# EAGLE design Adafruit LM73100 Ideal Diode Breakout (EAGLE 9.6.2)
COMPANY: ADAFRUIT INDUSTRIES; DRAWN: KTOWN; REV: A
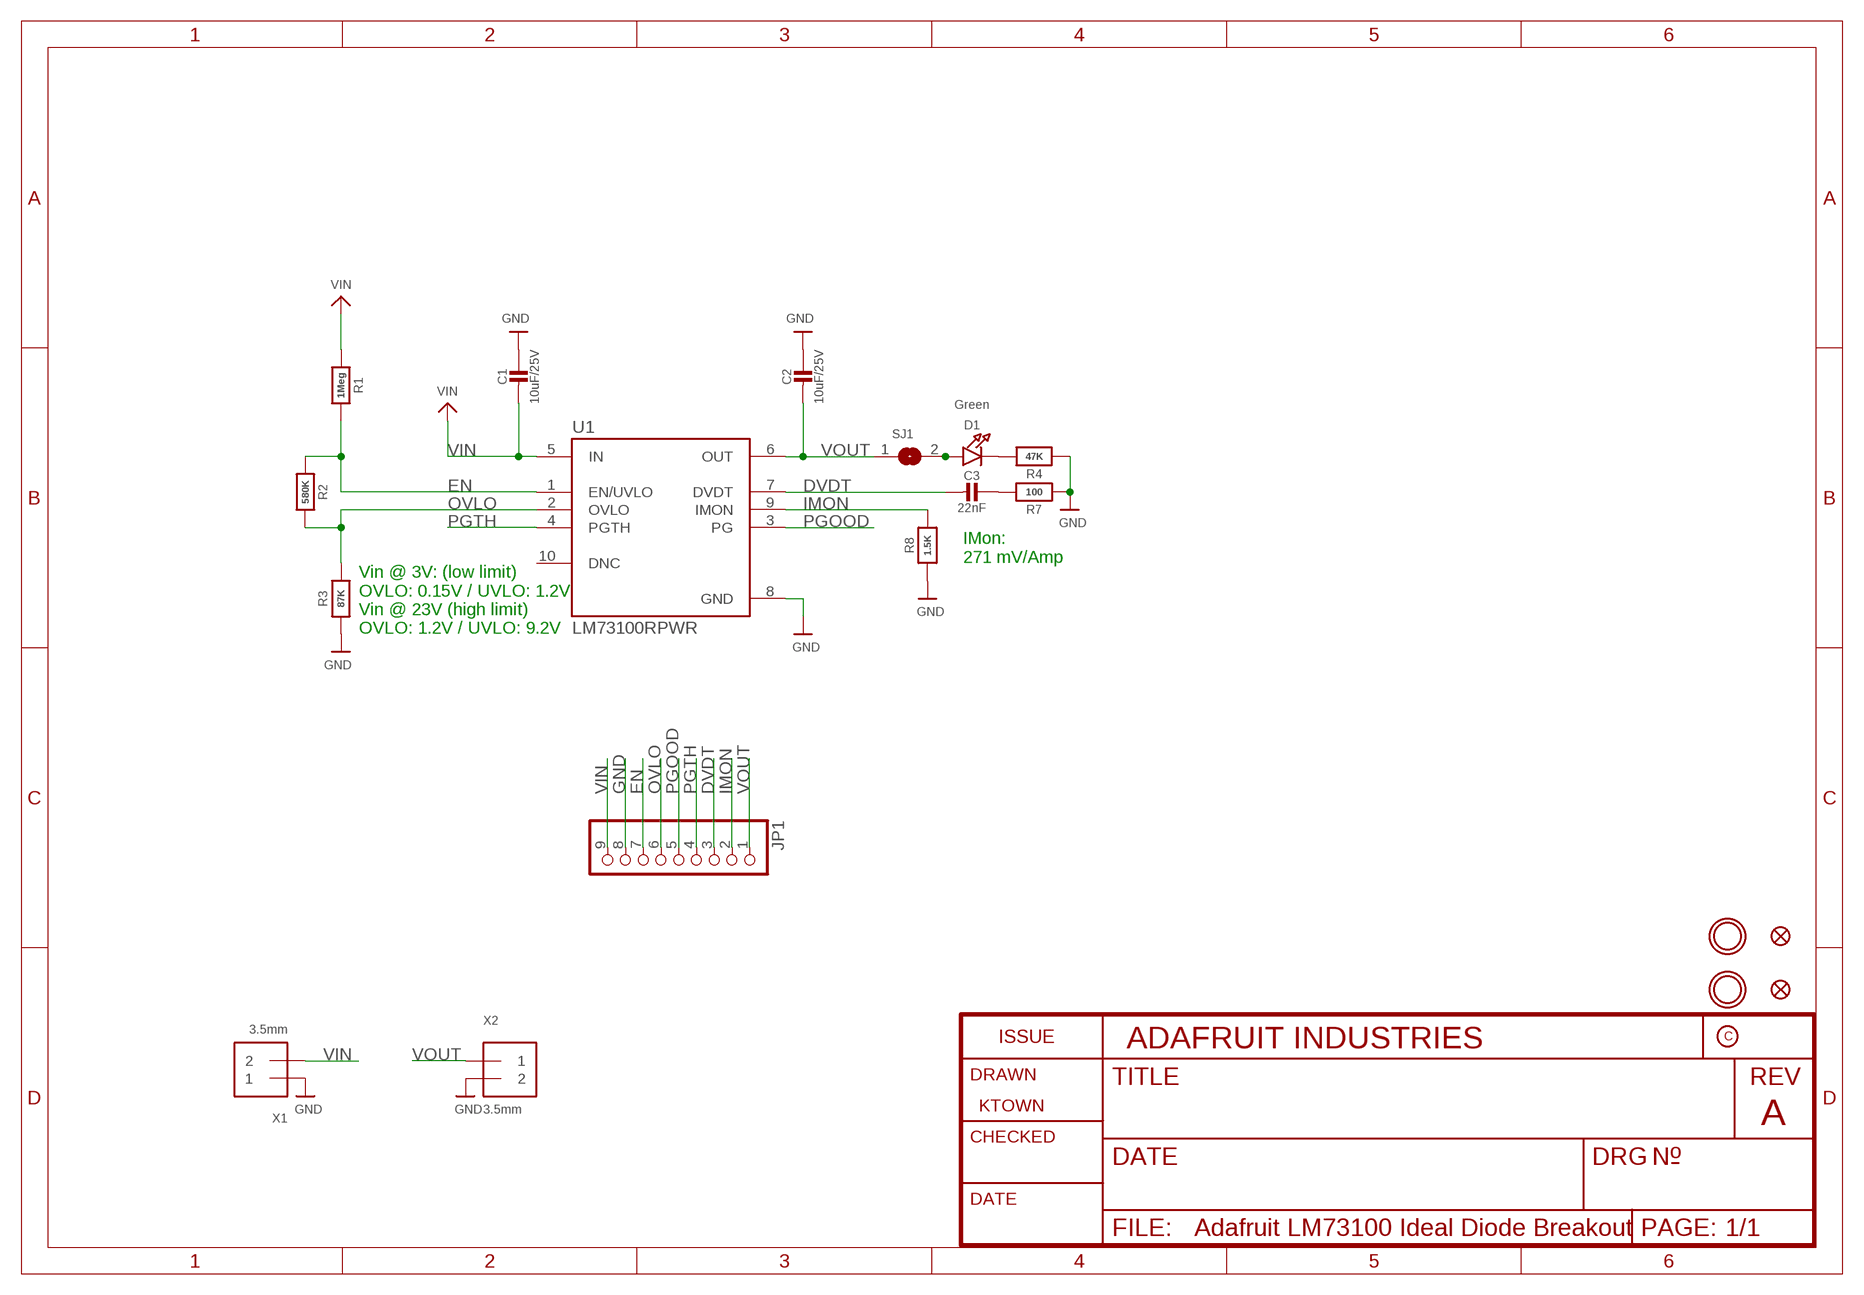
[diagram p0: schematic, sheet 1]

## Parts
C1  10uF/25V  CAP_CERAMIC0805-NOOUTLINE  [0805-NO]
C2  10uF/25V  CAP_CERAMIC0805-NOOUTLINE  [0805-NO]
C3  22nF  CAP_CERAMIC0603_NO  [0603-NO]
D1  Green  LED0603_NOOUTLINE  [CHIPLED_0603_NOOUTLINE]
FID1  FIDUCIAL_0.5MM  [FIDUCIAL_0.5MM]
FID2  FIDUCIAL_0.5MM  [FIDUCIAL_0.5MM]
JP1  HEADER-1X970MIL  [1X09_ROUND_70]
R1  1Meg  RESISTOR_0603_NOOUT  [0603-NO]
R2  580K  RESISTOR_0603_NOOUT  [0603-NO]
R3  87K  RESISTOR_0603_NOOUT  [0603-NO]
R4  47K  RESISTOR_0603_NOOUT  [0603-NO]
R7  100  RESISTOR_0603_NOOUT  [0603-NO]
R8  1.5K  RESISTOR_0402NO  [_0402NO]
SJ1  SOLDERJUMPERCLOSED  [SOLDERJUMPER_CLOSEDWIRE]
U1  LM73100RPWR  [IC_LM73100RPWR]
U$1  MOUNTINGHOLE2.5  [MOUNTINGHOLE_2.5_PLATED]
U$9  MOUNTINGHOLE2.5  [MOUNTINGHOLE_2.5_PLATED]
X1  3.5mm  TERMBLOCK_1X2_3.5MM  [TERMBLOCK_1X2-3.5MM]
X2  3.5mm  TERMBLOCK_1X2_3.5MM  [TERMBLOCK_1X2-3.5MM]

## Nets
DVDT: C3.2 JP1.3 U1.7(DVDT)
EN: JP1.7 R1.1 R2.2 U1.1(EN/UVLO)
GND: C1.1 C2.1 JP1.8 R3.2 R4.2 R7.1 R8.1 U1.8(GND) X1.1 X2.2
IMON: JP1.2 R8.2 U1.9(IMON)
N$1: C3.1 R7.2
N$2: D1.C R4.1
N$3: D1.A SJ1.2
OVLO: JP1.6 R2.1 R3.1 U1.2(OVLO)
PGOOD: JP1.5 U1.3(PG)
PGTH: JP1.4 U1.4(PGTH)
VIN: C1.2 JP1.9 R1.2 U1.5(IN) X1.2
VOUT: C2.2 JP1.1 SJ1.1 U1.6(OUT) X2.1
Unconnected: U1.10(DNC)

## Notes on the sheet
- IMon:
  271 mV/Amp
- Vin @ 3V: (low limit)
  OVLO: 0.15V / UVLO: 1.2V
  Vin @ 23V (high limit)
  OVLO: 1.2V / UVLO: 9.2V

## Library data of the parts
C1-C3 = microbuilder:CAP_CERAMIC: Ceramic Capacitors For new designs, use the packages preceded by an '_' character since they are more reliable: The following footprints should be used on most boards: _0402 - Standard footprint for regular board layouts _0603 - Standard footprint for regular board layouts _0805 - Standard footprint for regular board layouts _1206 - Standard footprint for regular board layouts For extremely tight-pitch boards where space is at a premium, the following 'micro-pitch' footprints can be used (smaller pads, no silkscreen outline, etc.): _0402MP - Micro-pitch footprint for very dense/compact boards _0603MP - Micro-pitch footprint for very dense/compact boards _0805MP - Micro-pitch footprint for very dense/compact boards _1206MP - Micro-pitch footprint for very dense/compact boards
D1 = microbuilder:LED: LED 0603 - 0603 Surface Mount Package 2mA: Green LED - Low Power (3.9mcd, 2ma, 1.7Vf) - Digikey: 475-2709-2-ND Orange LED - Low Power (9.8mcd, 2ma, 1.8Vf) - Digikey: 475-1194-2-ND Red LED - Low Power (5mcd, 2ma, 1.8Vf) - Digikey: 475-1195-2-ND Yellow LED - Low Power (7mcd, 2ma, 1.8Vf) - Digikey: 475-1196-2-ND 5mA: Blue LED - Low Power (17mcd, 5ma, 2.9Vf) - Digikey: LNJ937W8CRACT-ND 0805 - 0805 Surface Mount Package 2mA: Red LED (8.8mcd, 2mA, 1.8Vf, Clear) - Low Power [Digikey: 475-2510-1-ND] Green LED (5mcd, 2mA, 1.8Vf, Clear) - Low Power [Digikey: 475-2730-1-ND] Yellow LED (11.3mcd, 2mA, 1.8Vf, Clear) - Low Power [Digikey: 475-2555-1-ND] 20mA: Red LED (104mcd, 20mA, Diffused) - LS R976 [Digikey: 475-1278-6-ND] Red LED (12mcd, 20mA, 2.0Vf, Clear) - APT2012EC [Digikey: 754-1128-1-ND] Green LED (15mcd, 20mA, 2.2Vf, Clear) - APT2012GC [Digikey: 754-1131-1-ND] Orange LED (160mcd, 20mA, 2.1Vf, Clear) - APT2012SECK [Digikey: 754-1130-1-ND] 1206 - 1206 Surface Mount Package Green LED (26mcd, 20mA, Diffused) - LG N971 [Digikey: 475-1407-6-ND] Red LED (15mcd, 20mA, Diffused) - LH N974 [Digikey: 475-1416-6-ND] Cree - Cree High-Power Surface Mount LEDs XPEBWT-L1-0000-00D50 - White 111lm 350mA 2.9Vf 6200K 110° XTEAWT-00-0000-00000LEE3 - White 114lm 350mA 2.85Vf 5000K 115° Everlight - Everlight 45-21 Series Surface Mount LEDs 45-21/QK2C-B2832AC2CB2/2T - Warm White 2000mcd 20mA 3.25Vf 3050K 120° 45-21/LK2C-B38452C4CB2/2T - Nuetral White 2000mcd 20mA 3.25Vf 4150K 120° 45-21/LK2C-B50634C6CB2/2T - Cold White 2200mcd 20mA 3.25Vf 5650K 120° PLCC2 Reverse Mount LS T77K-J1L2-1-0-2-R18-Z - Red 11.25mcd 2mA 1.8Vf 630nm 120° LO T77K-L1M2-24-Z - Orange 19.6mcd 2mA 1.8Vf 606nm 120° LY T77K-K2M1-26-Z - Yellow 15.7mcd 2mA 1.8Vf 587nm 120°; ROT: 270
FID1 FID2 = microbuilder:FIDUCIAL: Fiducial Alignment Points Various fiducial points for machine vision alignment.
JP1 = microbuilder:HEADER-1X9: PIN HEADER
R1-R4 R7 R8 = microbuilder:RESISTOR: Resistors For new designs, use the packages preceded by an '_' character since they are more reliable: The following footprints should be used on most boards: _0402 - Standard footprint for regular board layouts _0603 - Standard footprint for regular board layouts _0805 - Standard footprint for regular board layouts _1206 - Standard footprint for regular board layouts For extremely tight-pitch boards where space is at a premium, the following 'micro-pitch' footprints can be used (smaller pads, no silkscreen outline, etc.): _0402MP - Micro-pitch footprint for very dense/compact boards _0603MP - Micro-pitch footprint for very dense/compact boards _0805MP - Micro-pitch footprint for very dense/compact boards _1206MP - Micro-pitch footprint for very dense/compact boards
SJ1 = microbuilder:SOLDERJUMPER: SMD Solder JUMPER Solder the two pads together to create a connection, or remove the solder to break it. REFLOW - Use this footprint for solder paste and reflow ovens. WAVE - Use this footprint for hand-soldering (larger pads). CLOSED - Has a trace between the two pads to ensure it is closed by default. The trace needs to be cut to disable the jumper, and can be closed again by creating a solder bridge between the two pads.
U1 = adafruit_power:LM73100RPWR; MANUFACTURER: Texas Instruments; MAXIMUM_PACKAGE_HEIGHT: 1 mm; PARTREV: 08/2019; SNAPEDA_PN: LM73100RPWR; STANDARD: Manufacturer Recommendations
U$1 U$9 = adafruit_electromech:MOUNTINGHOLE: Mounting Hole For #2 screws (0.086"/2.18mm width, 0.094"/2.4mm hole) use 2.5mm; BOM: EXCLUDE
X1 X2 = adafruit_electromech:TERMBLOCK_1X2: 3.5mm Terminal block http://www.ladyada.net/library/pcb/eaglelibrary.html; ROT: 0

## Board
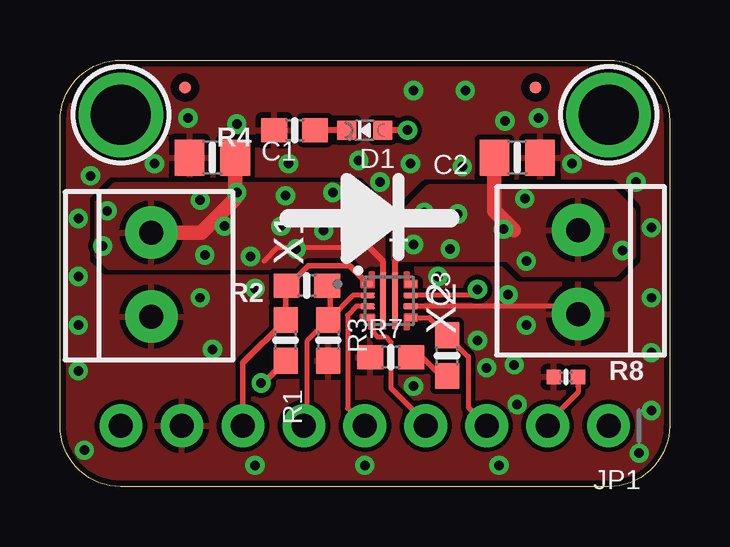
[diagram p1: board, top side]
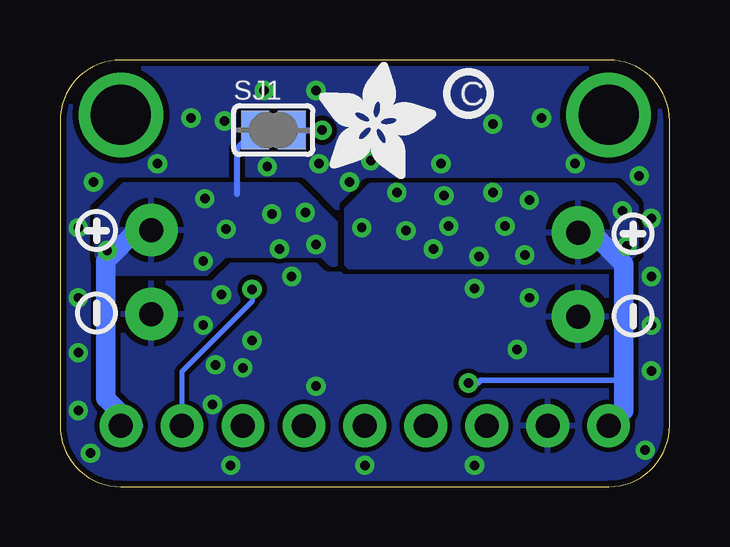
[diagram p2: board, bottom side, seen from below]

Size 25.4 x 17.78 mm. Coordinates in mm from the lower left corner, seen from the top.
Outline: 22.86,0 2.54,0 arc-90 0,2.54 0,15.24 arc-90 2.54,17.78 22.86,17.78 arc-90 25.4,15.24 25.4,2.54 arc-90 22.86,0
Copper layers (1*16): Top 0.035mm / dielectric 1.5mm / Bottom 0.035mm
Design rules "adafruit *": minimum track width 8mil, minimum drill 15.5mil, track to track 8mil, track to pad 8mil, pad to pad 8mil, via to via 8mil, smd to smd 8mil, copper to edge 10mil, drill to drill 8mil, minimum pad ring 10mil, minimum via ring 8mil, stop-mask expansion 2mil, vias tented up to drill 20mil, thermal gap 10mil

### Footprints (pad centres in the part's own frame; a part is rotated, then mirrored left to right if it is on the bottom)
0805-NO = smd 1.24 x 1.5: 1 -0.95,0; 2 0.95,0
0603-NO = smd 1.075 x 1: 1 -0.85,0; 2 0.85,0
CHIPLED_0603_NOOUTLINE = smd 0.8 x 0.8: A 0,-0.75; C 0,0.75
FIDUCIAL_0.5MM = smd 0.5 x 0.5: 1 0,0
1X09_ROUND_70 = drill 1 pad 1.778: 1 -10.16,0; 2 -7.62,0; 3 -5.08,0; 4 -2.54,0; 5 0,0; 6 2.54,0; 7 5.08,0; 8 7.62,0; 9 10.16,0
_0402NO = smd 0.6 x 0.6: 1 -0.508,0; 2 0.508,0
SOLDERJUMPER_CLOSEDWIRE = smd 1.168 x 1.6: 1 -0.762,0; 2 0.762,0 | smd 0.635 x 0.203: WIRE 0,0
IC_LM73100RPWR = smd 0.5 x 0.25: 1 -0.9,0.7; 4 -0.9,-0.7; 7 0.9,-0.7; 10 0.9,0.7 | smd 0.6 x 0.225: 2 -0.9,0.225; 3 -0.9,-0.225; 8 0.9,-0.225; 9 0.9,0.225 | smd 0.28 x 2.4: 5 -0.25,0; 6 0.25,0
MOUNTINGHOLE_2.5_PLATED = drill 2.5 pad 3.2: P$1 0,0
TERMBLOCK_1X2-3.5MM = drill 1 pad 2.184: 1 1.8,0; 2 -1.7,0

### Placement (x,y rotation side)
C1  6.35,13.72 0 top
C2  19.05,13.72 180 top
C3  16.13,5.46 90 top
D1  12.7,14.86 90 top
FID1  19.81,16.64 0 top
FID2  5.21,16.64 0 top
JP1  12.7,2.54 180 top
PLABEL2  [PLABEL2]  5.08,0.89 0 top
PLABEL3  [PLABEL3]  23.62,4.19 0 top
PLABEL7  [PLABEL7]  2.54,4.19 0 top
PLABEL8  [PLABEL8]  12.45,16.51 0 top
PLABEL9  [PLABEL9]  12.57,13.72 0 top
PLABEL10  [PLABEL10]  8.13,10.79 90 top
PLABEL12  [PLABEL12]  8.13,6.99 90 top
PLABEL13  [PLABEL13]  17.4,7.24 90 top
PLABEL14  [PLABEL14]  7.75,4.19 0 top
PLABEL15  [PLABEL15]  10.41,0.89 0 top
PLABEL16  [PLABEL16]  12.7,4.06 0 top
PLABEL17  [PLABEL17]  15.37,0.89 0 top
PLABEL18  [PLABEL18]  18.29,4.19 0 top
PLABEL19  [PLABEL19]  20.45,0.89 0 top
PLABEL20  [PLABEL20]  12.7,11.3 0 bottom
PLABEL21  [PLABEL21]  12.7,7.37 0 bottom
PLABEL22  [PLABEL22]  16.38,16.64 0 bottom
PLABEL23  [PLABEL23]  22.99,12.83 0 bottom
PLABEL24  [PLABEL24]  1.91,12.57 0 bottom
PLABEL25  [PLABEL25]  17.4,11.3 90 top
R1  9.4,6.1 270 top
R2  10.29,8.38 180 top
R3  11.18,6.1 270 top
R4  9.78,14.86 180 top
R7  13.78,5.4 0 top
R8  21.08,4.57 0 top
SJ1  16.51,14.86 0 bottom
U1  13.72,7.75 0 top
U$1  22.86,15.49 0 top
U$9  2.54,15.49 0 top
U$10  [PCBFEAT-REV-040]  8.38,16.38 0 bottom
U$14  [ADAFRUIT_5MM]  14.61,12.83 0 bottom
U$15  [SYMBOL_MINUS]  23.88,7.24 270 bottom
U$16  [SYMBOL_PLUS]  23.88,10.67 0 bottom
U$17  [SYMBOL_PLUS]  1.52,10.54 0 bottom
U$18  [SYMBOL_MINUS]  1.52,7.11 270 bottom
X1  3.81,8.89 270 top
X2  21.59,8.89 90 top

### Tracks (layer width: path | path; a pad name or v marks a point on that pad's centre or on a via)
DVDT
  Top 0.203: U1.7 15.39,7.05 C3.2 17.02,5.42 17.02,3.3 JP1.3
EN
  Top 0.229: JP1.7 7.62,5.17 R1.1 9.4,8.34 R2.2 9.52,8.38 10.34,9.2 12.06,9.2 U1.1
GND  (via drill 0.39)
  Top 0.203: X2.2 21.26,7.52 U1.8
  other vias: 9.53,13.46 12.45,13.59 14.61,13.46 14.73,16.51 13.34,12.7 16.76,13.34 16.89,16.51 18.54,15.24 19.94,15.37 21.34,13.46 7.37,15.11 5.33,15.37 18.67,8 17.4,6.1 14.73,4.19 18.92,5.08 17.78,4.95 19.05,3.43 19.43,6.73 24.64,7.87 24.64,5.59 24.64,3.17 24.64,10.79 24,12.7 1.27,12.95 3.94,13.46 0.76,11.18 0.76,8.76 0.76,6.73 0.76,4.83 5.84,7.87 8.13,8.26 6.35,5.71 18.29,0.89 12.7,0.89 8.13,0.89 24.13,1.4 1.02,1.52 15.75,8.76
  pour Top (rank 2): 0,0 0,17.78 25.02,17.78 25.4,17.78 25.4,1.27 25.4,0
  pour Bottom (rank 2): 0,0 0,17.78 25.02,17.78 25.4,17.78 25.4,1.27 25.4,0
IMON  (via drill 0.39)
  Top 0.203: v17.4,8.23 17.14,7.97 U1.9 | 21.59,4.19 21.59,3.94 20.32,2.67 JP1.2
  Top 0.229: R8.2 21.59,4.19
  Bottom 0.203: v17.4,8.23 17.4,7.72 20.32,4.8 JP1.2
N$1
  Top 0.203: C3.1 15.88,4.61 15.09,5.4 R7.2
N$2
  Top 0.254: D1.C R4.1
N$3  (via drill 0.39)
  Top 0.254: v14.48,14.86 D1.A
  Bottom 0.254: SJ1.2 v14.48,14.86
OVLO
  Top 0.203: U1.2 12.2,7.97 11.26,7.03 R3.1 10.29,6.06 10.29,2.67 JP1.6
  Top 0.229: R2.1 11.26,8.26 11.26,7.03
PGOOD
  Top 0.203: U1.3 12.35,7.52 11.98,7.16 11.98,3.26 12.32,2.92 JP1.5
PGTH
  Top 0.203: JP1.4 15.24,2.67 13.79,4.12 13.79,6.03 13.57,6.24 13.23,6.24 13.02,6.45 13.02,6.84 U1.4
VIN  (via drill 0.39)
  Top 0.203: 8.51,9.4 9.08,9.97 12.89,9.97
  Top 0.229: R1.2 8.47,4.32 v8.38,4.32
  Top 0.254: 12.89,9.97 13.47,9.39 U1.5
  Top 0.61: C1.2 7.3,12 5.89,10.59 X1.2
  Bottom 0.229: v8.38,4.32 8,4.32 7.87,4.45 2.03,4.45 1.91,4.57
  Bottom 0.813: X1.2 3.22,10.59 1.91,9.27 1.91,4.57 1.91,3.17 JP1.9
  other vias: 9.4,12.13 12.83,10.79 10.99,10.67 11.37,12.26 9.84,9.91 9.21,10.86 6.86,10.86 7.94,9.59 6.03,9.65 5.84,11.94 1.97,11.49 1.78,10.03 7.37,12.26
  pour Top: 2.29,12.57 1.52,11.81 1.52,9.65 2.03,9.14 13.46,9.14 13.46,11.43 12.32,12.57
  pour Bottom: 2.29,12.57 1.4,11.68 1.4,9.78 2.03,9.14 13.34,9.14 13.46,9.27 13.46,11.56 12.45,12.57
VOUT  (via drill 0.39)
  Top 0.254: 14.22,9.65 13.97,9.39 U1.6
  Top 0.61: C2.2 18.1,11.49 18.9,10.69
  Bottom 0.254: SJ1.1 18.03,14.1 18.03,12.19
  Bottom 0.813: JP1.1 22.35,2.54 23.5,3.68 23.5,9.4 22.2,10.69 X2.1
  other vias: 14.73,10.1 16.57,11.37 19.37,12 18.48,10.73 19.43,9.4 23.43,9.84 16.26,9.91 15.18,11.43
  pour Top: 18.67,9.47 13.9,9.47 13.9,11.03 15.39,12.51 22.86,12.51 23.88,11.5 23.88,9.59 23.11,8.83 19.3,8.83
  pour Bottom: 13.91,9.27 13.91,10.99 15.49,12.57 22.73,12.57 23.88,11.43 23.88,9.65 23.11,8.89 19.3,8.89 18.54,9.65 14.48,9.65 14.1,9.27

### Text on the board
Pinguin_tBackup: LM73100 | Ideal Diode | IN | OUT | LM66200 | Ideal Diodes | GND | GND | 1 | 2 | UVLO | Vout | PG | Sta | DVDT | VIN | GND | OVLO | !On | PGTH | IMON
Pinguin_bBackup: LED | LM73100 | LM66200 | Ideal Diode Ron=29mΩ / Polarity Protection / Vin: 3~22V @5A Max | Vin | 2.5A Out / VINs: 1.6-5.5V | Vout